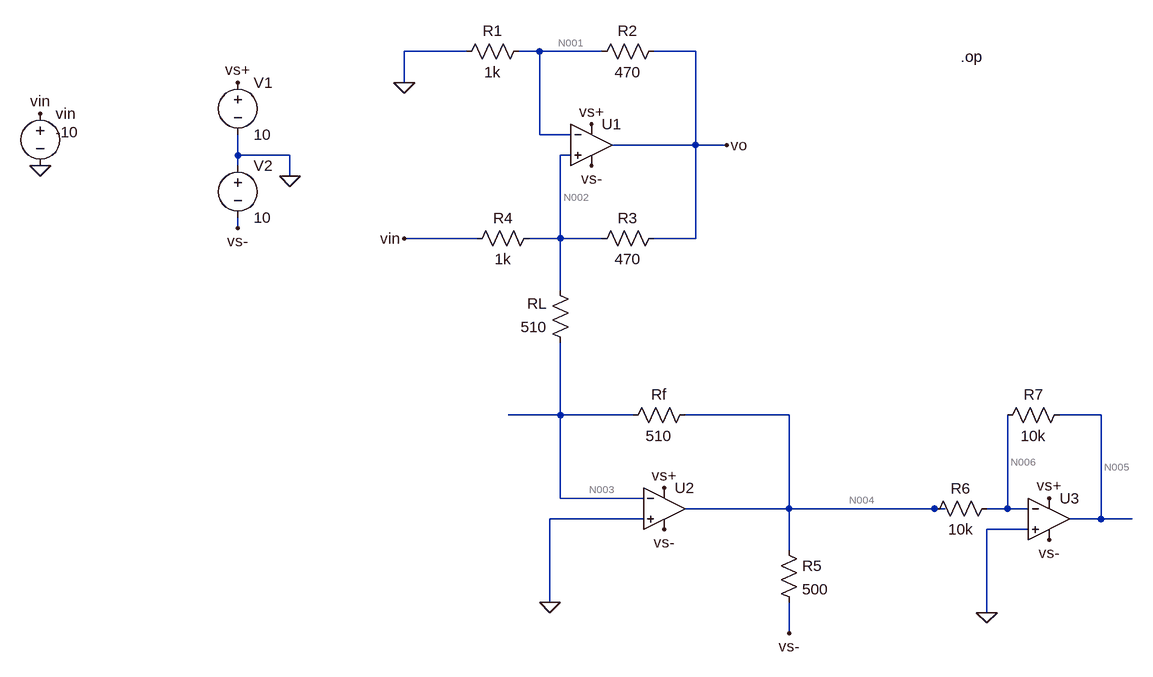
[diagram p0: schematic Task2.asc]
Task2.asc, the LTspice schematic file:
Version 4.1
SHEET 1 1300 976
WIRE 0 0 -96 0
WIRE 112 0 80 0
WIRE 208 0 112 0
WIRE 352 0 288 0
WIRE -96 48 -96 0
WIRE 112 128 112 0
WIRE 160 128 112 128
WIRE 352 144 352 0
WIRE 352 144 224 144
WIRE 400 144 352 144
WIRE -352 160 -352 128
WIRE -272 160 -352 160
WIRE 160 160 144 160
WIRE -352 176 -352 160
WIRE -272 192 -272 160
WIRE -352 272 -352 256
WIRE 16 288 -96 288
WIRE 144 288 144 160
WIRE 144 288 96 288
WIRE 208 288 144 288
WIRE 352 288 352 144
WIRE 352 288 288 288
WIRE 144 368 144 288
WIRE 144 560 144 448
WIRE 144 560 64 560
WIRE 256 560 144 560
WIRE 496 560 336 560
WIRE 976 560 912 560
WIRE 144 688 144 560
WIRE 272 688 144 688
WIRE 496 704 496 560
WIRE 496 704 336 704
WIRE 720 704 496 704
WIRE 736 704 720 704
WIRE 832 704 832 560
WIRE 832 704 800 704
WIRE 864 704 832 704
WIRE 272 720 128 720
WIRE 976 720 976 560
WIRE 976 720 928 720
WIRE 1024 720 976 720
WIRE 864 736 800 736
WIRE 496 768 496 704
WIRE 128 848 128 720
WIRE 800 864 800 736
WIRE 496 896 496 848
FLAG -96 48 0
FLAG 400 144 vo
FLAG 192 176 vs-
FLAG 192 112 vs+
FLAG -96 288 vin
FLAG -272 192 0
FLAG -352 272 vs-
FLAG -352 48 vs+
FLAG -656 176 0
FLAG -656 96 vin
FLAG 304 736 vs-
FLAG 304 672 vs+
FLAG 128 848 0
FLAG 896 752 vs-
FLAG 896 688 vs+
FLAG 496 896 vs-
FLAG 800 864 0
SYMBOL res 96 -16 R90
WINDOW 0 0 56 VBottom 2
WINDOW 3 32 56 VTop 2
SYMATTR InstName R1
SYMATTR Value 1k
SYMBOL res 304 -16 R90
WINDOW 0 0 56 VBottom 2
WINDOW 3 32 56 VTop 2
SYMATTR InstName R2
SYMATTR Value 470
SYMBOL res 304 272 R90
WINDOW 0 0 56 VBottom 2
WINDOW 3 32 56 VTop 2
SYMATTR InstName R3
SYMATTR Value 470
SYMBOL res 112 272 R90
WINDOW 0 0 56 VBottom 2
WINDOW 3 32 56 VTop 2
SYMATTR InstName R4
SYMATTR Value 1k
SYMBOL res 160 464 R180
WINDOW 0 36 76 Left 2
WINDOW 3 36 40 Left 2
SYMATTR InstName RL
SYMATTR Value 510
SYMBOL voltage -352 32 R0
WINDOW 123 0 0 Left 0
WINDOW 39 0 0 Left 0
SYMATTR InstName V1
SYMATTR Value 10
SYMBOL voltage -656 80 R0
WINDOW 123 0 0 Left 0
WINDOW 39 0 0 Left 0
WINDOW 3 24 44 Left 2
SYMATTR Value -10
SYMATTR InstName vin
SYMBOL OpAmps\\UniversalOpAmp1 192 144 R0
SYMATTR InstName U1
SYMBOL OpAmps\\UniversalOpAmp1 304 704 R0
SYMATTR InstName U2
SYMBOL res 480 752 R0
SYMATTR InstName R5
SYMATTR Value 500
SYMBOL res 352 544 R90
WINDOW 0 0 56 VBottom 2
WINDOW 3 32 56 VTop 2
SYMATTR InstName Rf
SYMATTR Value 510
SYMBOL OpAmps\\UniversalOpAmp1 896 720 R0
SYMATTR InstName U3
SYMBOL res 816 688 R90
WINDOW 0 0 56 VBottom 2
WINDOW 3 32 56 VTop 2
SYMATTR InstName R6
SYMATTR Value 10k
SYMBOL res 928 544 R90
WINDOW 0 0 56 VBottom 2
WINDOW 3 32 56 VTop 2
SYMATTR InstName R7
SYMATTR Value 10k
SYMBOL voltage -352 160 R0
WINDOW 123 0 0 Left 0
WINDOW 39 0 0 Left 0
SYMATTR InstName V2
SYMATTR Value 10
TEXT 760 8 Left 2 !.op

The netlist it stands for:
* Task2.asc
R1 N001 0 1k
R2 vo N001 470
R3 vo N002 470
R4 N002 vin 1k
RL N003 N002 510
V1 vs+ 0 10
vin vin 0 -10
X§U1 N002 N001 vs+ vs- vo level1 Avol=1Meg GBW=10Meg Vos=0 En=0 Enk=0 In=0 Ink=0 Rin=500Meg  ; pins In+ In- V+ V- OUT
X§U2 0 N003 vs+ vs- N004 level1 Avol=1Meg GBW=10Meg Vos=0 En=0 Enk=0 In=0 Ink=0 Rin=500Meg  ; pins In+ In- V+ V- OUT
R5 N004 vs- 500
Rf N004 N003 510
X§U3 0 N006 vs+ vs- N005 level1 Avol=1Meg GBW=10Meg Vos=0 En=0 Enk=0 In=0 Ink=0 Rin=500Meg  ; pins In+ In- V+ V- OUT
R6 N006 N004 10k
R7 N005 N006 10k
V2 0 vs- 10
.op
.lib UniversalOpAmp1.lib
.backanno
.end

* Results of the author's LTspice run, read from the files saved beside the schematic
* Operating Point:
*   V(n001) = -5.1 V
*   V(n002) = -5.1 V
*   V(n003) = -5.104 µV
*   V(n004) = 5.1 V
*   V(n005) = -5.1 V
*   V(n006) = 5.1 µV
*   V(vin) = -10 V
*   V(vo) = -7.497 V
*   V(vs+) = 10 V
*   V(vs-) = -10 V
*   I(R1) = -5.1 mA
*   I(R2) = -5.1 mA
*   I(R3) = -5.1 mA
*   I(R4) = 4.9 mA
*   I(R5) = 30.2 mA
*   I(R6) = -510 µA
*   I(R7) = -510 µA
*   I(RL) = 10 mA
*   I(Rf) = 10 mA
*   I(V1) = -70.2 nA
*   I(V2) = -30.2 mA
*   I(vin) = 4.9 mA
*   Ix(u1:1) = -10.2 nA
*   Ix(u1:2) = -10.2 nA
*   Ix(u1:3) = 30.2 nA
*   Ix(u1:4) = -9.8 nA
*   Ix(u1:5) = 10.2 mA
*   Ix(u2:1) = 0 A
*   Ix(u2:2) = -10.21 fA
*   Ix(u2:3) = 20 nA
*   Ix(u2:4) = -20 nA
*   Ix(u2:5) = -40.71 mA
*   Ix(u3:1) = 0 A
*   Ix(u3:2) = 10.2 fA
*   Ix(u3:3) = 20 nA
*   Ix(u3:4) = -20 nA
*   Ix(u3:5) = 510 µA